# EAGLE design ControlBox-3.1 (EAGLE 9.6.1)

## Sheet 1 of 3
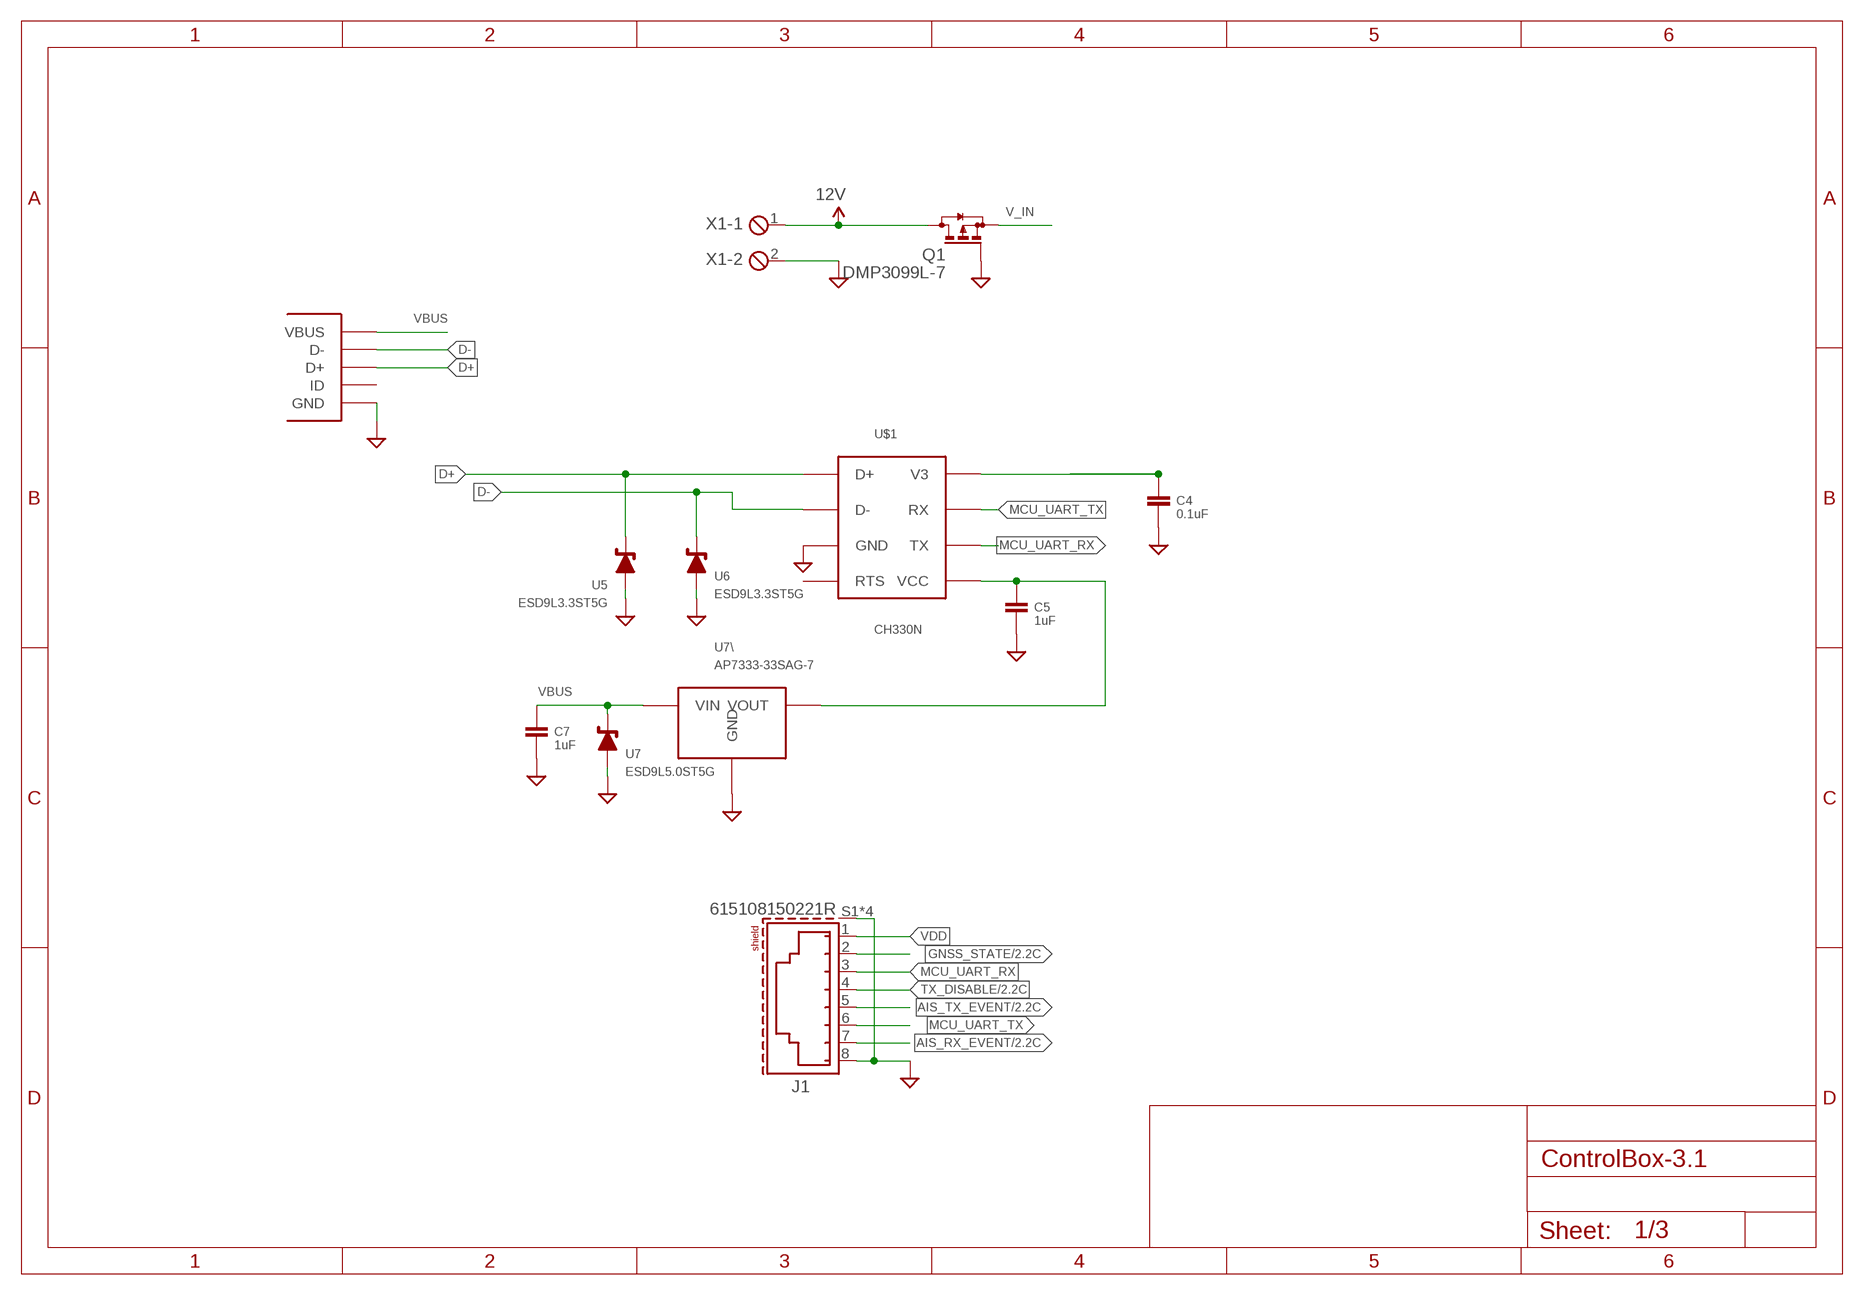
[diagram p0: schematic, sheet 1]

### Parts
C4  0.1uF  CAPACITOR0603  [0603]
C5  1uF  CAPACITOR0603  [0603]
C7  1uF  CAPACITOR0603  [0603]
J1  615108150221R  [615108150221R]
Q1  DMP3099L-7  BSS84  [SOT23]
U5  ESD9L3.3ST5G  [SODFL1006X40N]
U6  ESD9L3.3ST5G  [SODFL1006X40N]
U7  ESD9L5.0ST5G  [SODFL1006X40N]
U7\  AP7333-33SAG-7  [SOT-23]
U$1  CH330N  [SOIC-8]
U$2  MICRO_USB  [MICRO_USB]
X1  MPT2  [2POL254]

### Nets
12V: Q1.3(D) X1.1
AIS_RX_EVENT: J1.7 ; also sheet 2
AIS_TX_EVENT: J1.5 ; also sheet 2
D+: U5.1 U$1.1(D+) U$2.D+
D-: U6.1 U$1.2(D-) U$2.D-
GND: C4.P$2 C5.P$2 C7.P$2 J1.8 J1.S1(SHIELD) J1.S2(SHIELD) J1.S3(SHIELD) J1.S4(SHIELD) Q1.1(G) U5.2 U6.2 U7.2 U7\.3(GND) U$1.3(GND) U$2.GND U$2.MT1(GND) U$2.MT2(GND) U$2.P$1(GND) U$2.P$2(GND) X1.2 ; also sheet 2,3
GNSS_STATE: J1.2 ; also sheet 2
MCU_UART_RX: J1.3 U$1.6(TX)
MCU_UART_TX: J1.6 U$1.7(RX)
N$10: C4.P$1 U$1.8(V3)
N$12: C5.P$1 U7\.2(VOUT) U$1.5(VCC)
TX_DISABLE: J1.4 ; also sheet 2
V_IN: Q1.2(S) ; also sheet 3
VBUS: C7.P$1 U7.1 U7\.1(VIN) U$2.VBUS
VDD: J1.1 ; also sheet 3
Unconnected: U$1.4(RTS) U$2.ID

## Sheet 2 of 3
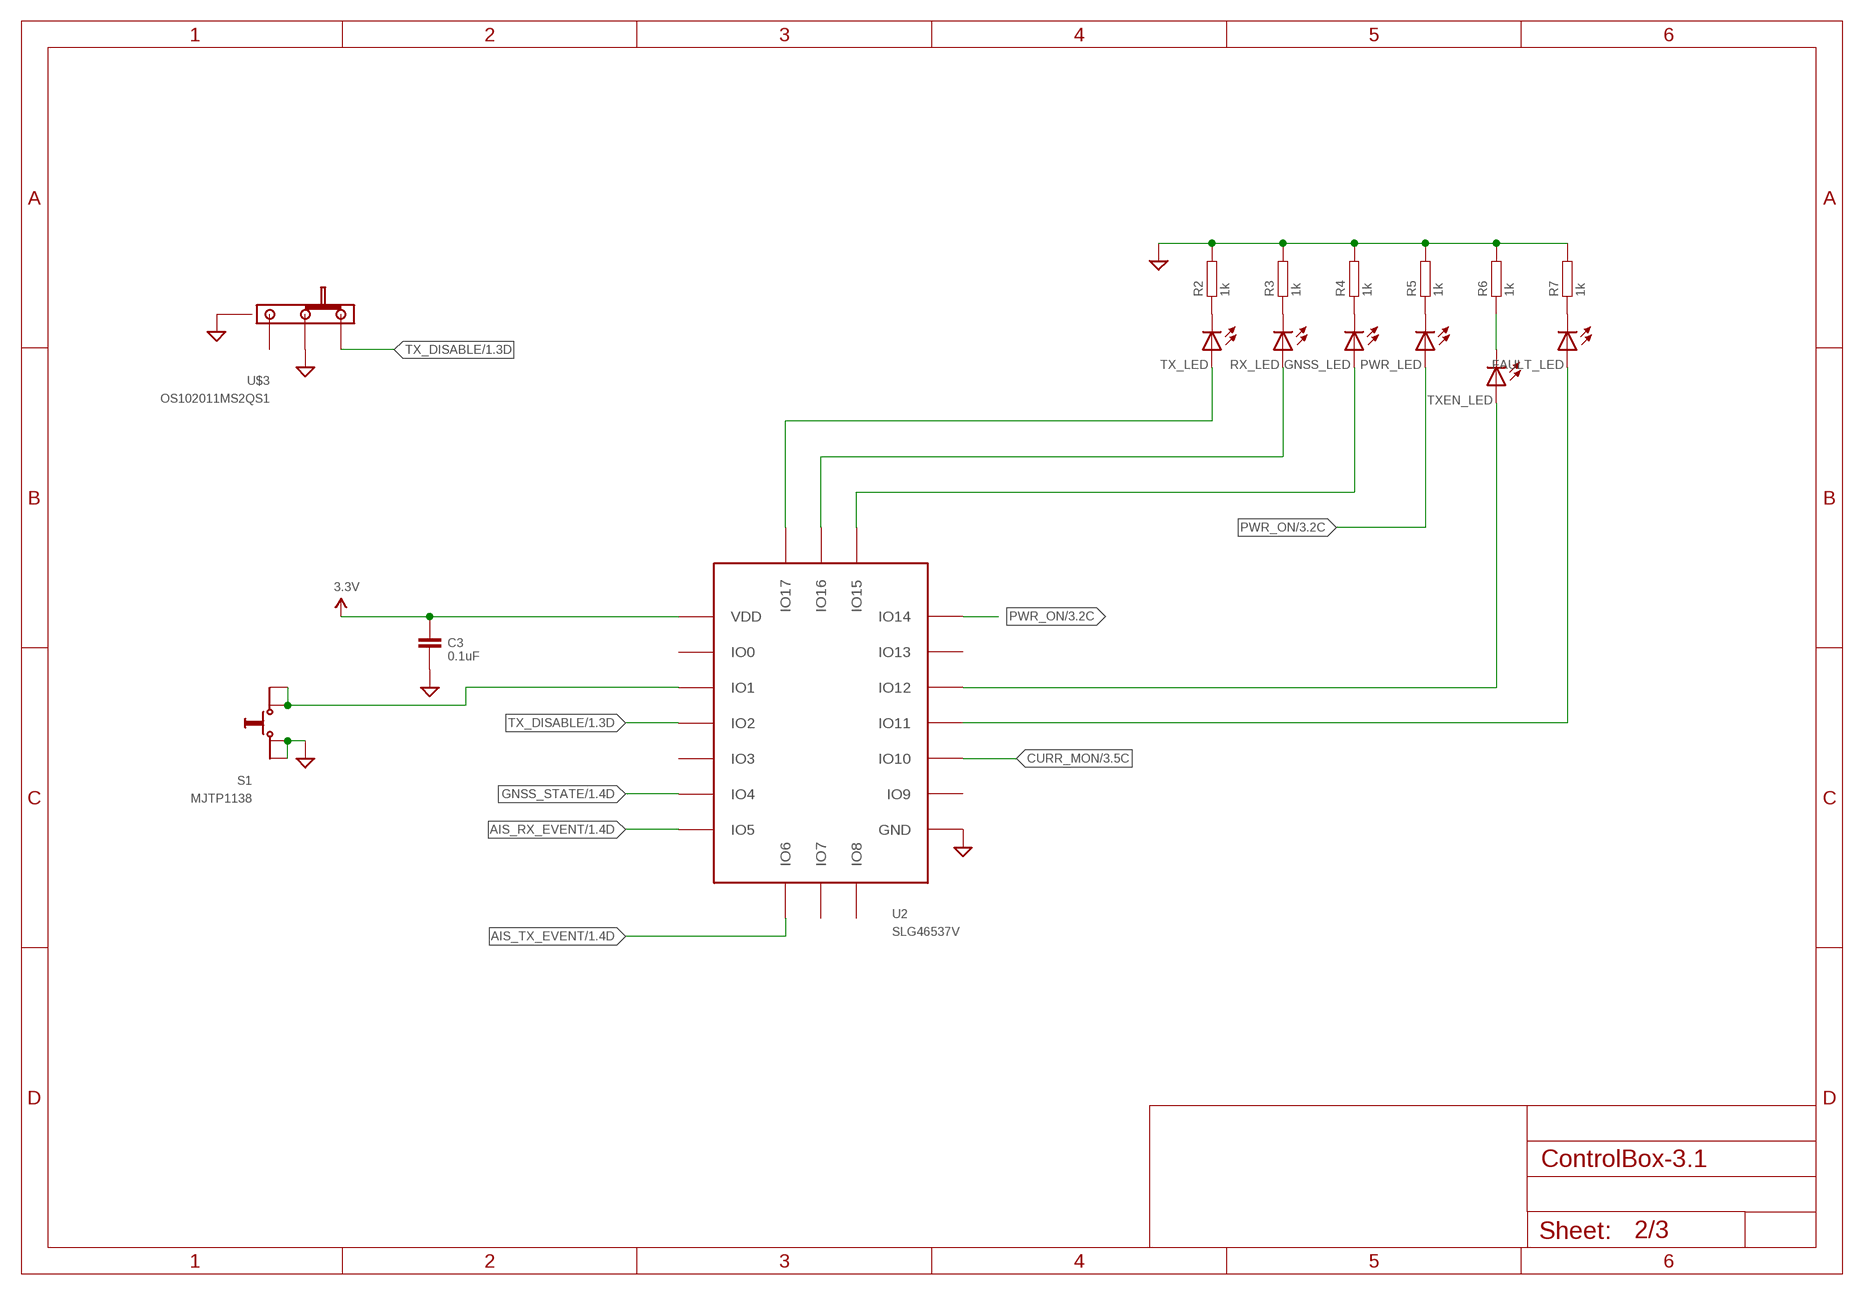
[diagram p1: schematic, sheet 2]

### Parts
C3  0.1uF  CAPACITOR0603  [0603]
FAULT_LED  LEDCHIPLED_0603  [CHIPLED_0603]
GNSS_LED  LEDCHIPLED_0603  [CHIPLED_0603]
PWR_LED  LEDCHIPLED_0603  [CHIPLED_0603]
R2  1k  RESISTOR0603  [0603]
R3  1k  RESISTOR0603  [0603]
R4  1k  RESISTOR0603  [0603]
R5  1k  RESISTOR0603  [0603]
R6  1k  RESISTOR0603  [0603]
R7  1k  RESISTOR0603  [0603]
RX_LED  LEDCHIPLED_0603  [CHIPLED_0603]
S1  MJTP1138  [MJTP1138]
TX_LED  LEDCHIPLED_0603  [CHIPLED_0603]
TXEN_LED  LEDCHIPLED_0603  [CHIPLED_0603]
U2  SLG46537V  SLG46537  [STQFN20L]
U$3  OS102011MS2QS1  [SPDT-PTH]

### Nets
3.3V: C3.P$1 U2.P$1(VDD) ; also sheet 3
AIS_RX_EVENT: U2.P$7(IO5) ; also sheet 1
AIS_TX_EVENT: U2.P$8(IO6) ; also sheet 1
BTN: S1.P$1(A) S1.P$4(A) U2.P$3(IO1)
CURR_MON: U2.P$13(IO10) ; also sheet 3
FAULT_LED: FAULT_LED.A U2.P$14(IO11)
GND: C3.P$2 R2.P$2 R3.P$2 R4.P$2 R5.P$2 R6.P$2 R7.P$2 S1.P$2(B) S1.P$3(B) U2.P$11(GND) U$3.P$2 U$3.P$4(SHLD) U$3.P$5(SHLD) ; also sheet 1,3
GNSS_LED: GNSS_LED.A U2.P$18(IO15)
GNSS_STATE: U2.P$6(IO4) ; also sheet 1
N$2: R2.P$1 TX_LED.C
N$3: R3.P$1 RX_LED.C
N$4: GNSS_LED.C R4.P$1
N$5: PWR_LED.C R5.P$1
N$6: R6.P$1 TXEN_LED.C
N$7: FAULT_LED.C R7.P$1
PWR_ON: PWR_LED.A U2.P$17(IO14) ; also sheet 3
RX_LED: RX_LED.A U2.P$19(IO16)
TX_DISABLE: U2.P$4(IO2) U$3.P$1 ; also sheet 1
TX_EN_LED: TXEN_LED.A U2.P$15(IO12)
TX_LED: TX_LED.A U2.P$20(IO17)
Unconnected: U2.P$2(IO0) U2.P$5(IO3) U2.P$9(IO7) U2.P$10(IO8) U2.P$12(IO9) U2.P$16(IO13) U$3.P$3

## Sheet 3 of 3
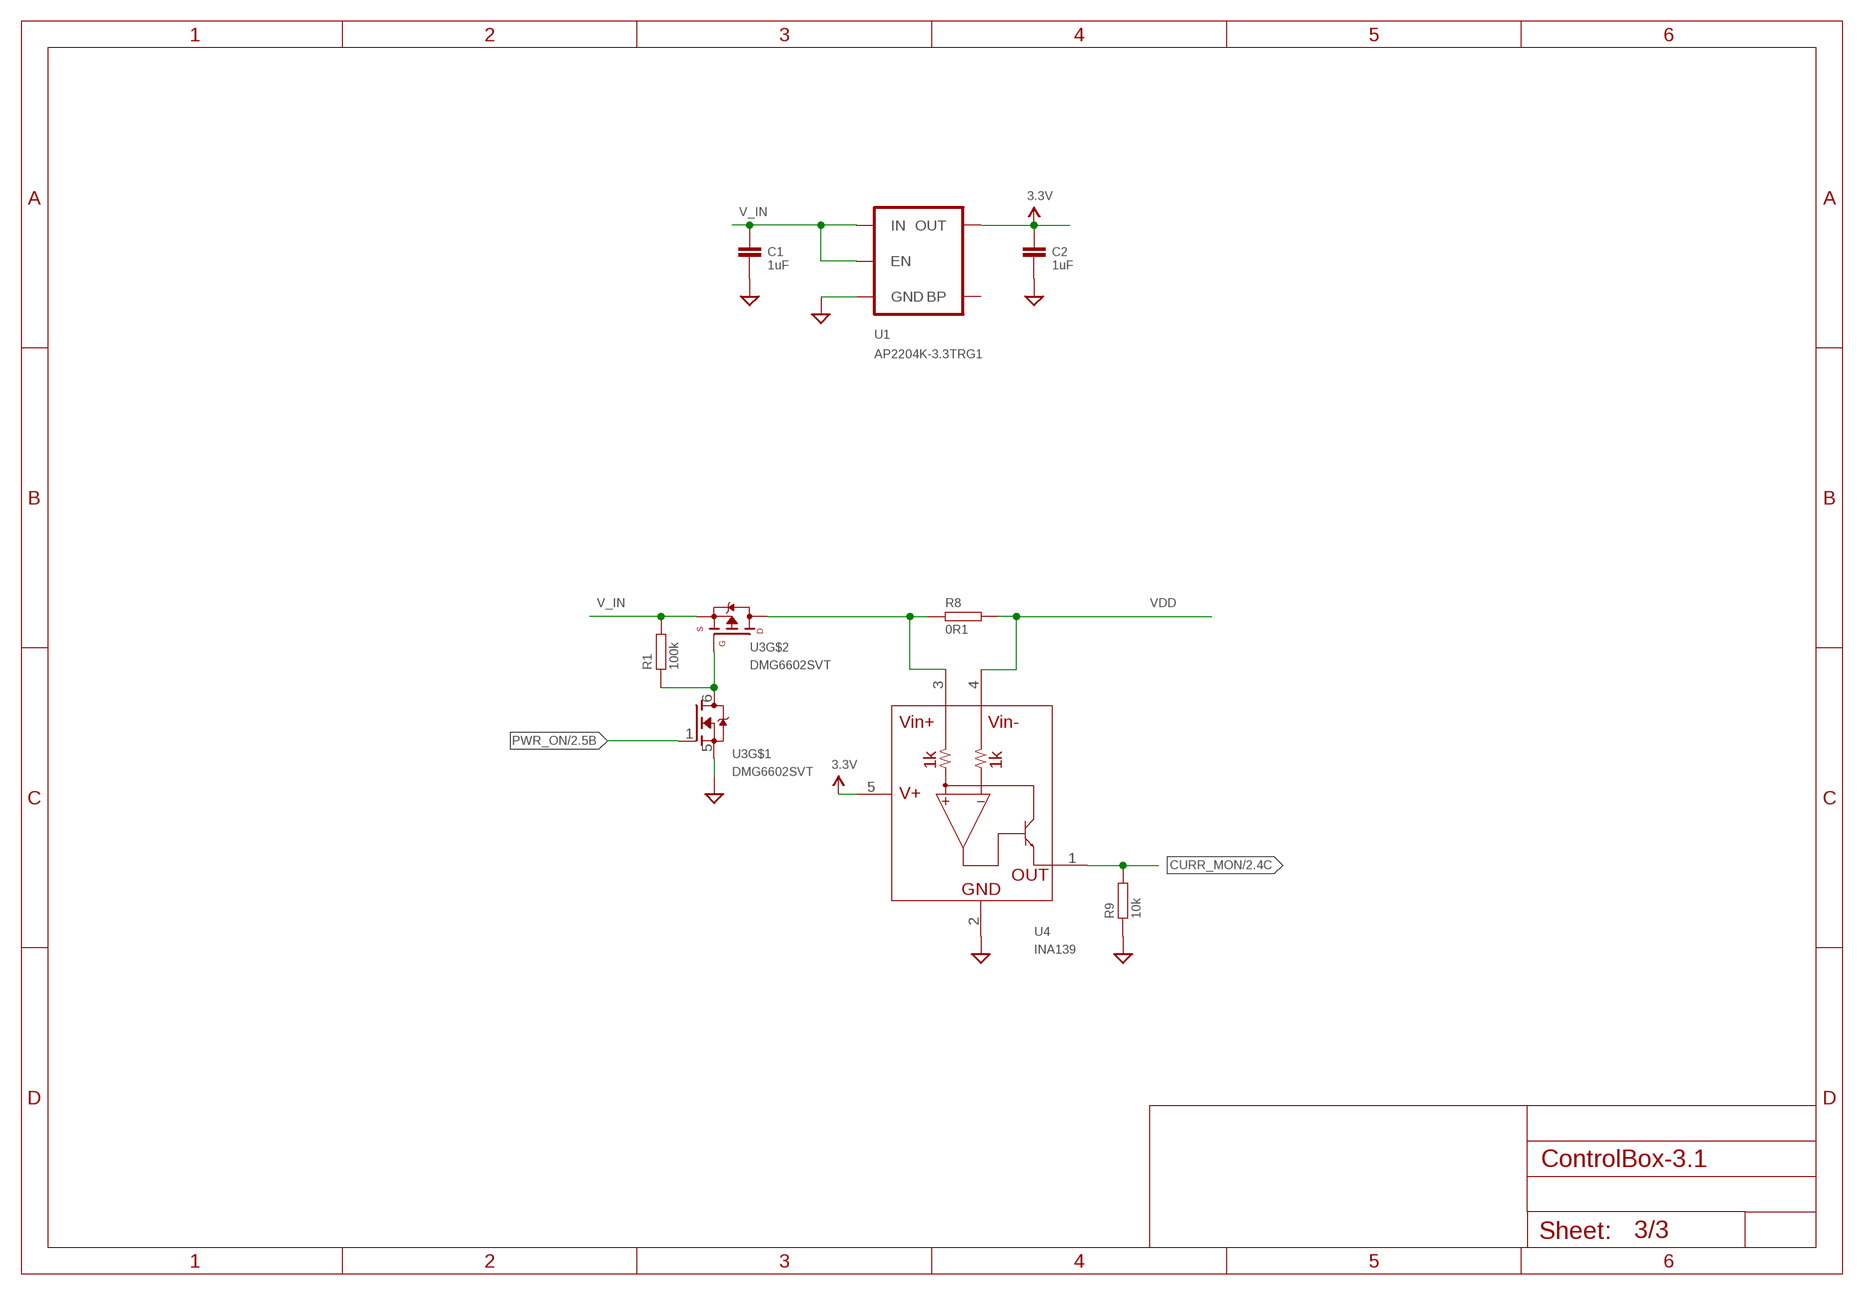
[diagram p2: schematic, sheet 3]

### Parts
C1  1uF  CAPACITOR0603  [0603]
C2  1uF  CAPACITOR0603  [0603]
R1  100k  RESISTOR0603  [0603]
R8  0R1  RESISTOR1206  [1206]
R9  10k  RESISTOR0603  [0603]
U1  AP2204K-3.3TRG1  V_REG_LDOSMD  [SOT23-5]
U3  DMG6602SVT  [SOT23-6]
U4  INA139  INA169  [SOT23-5]

### Nets
3.3V: C2.P$1 U1.5(OUT) U4.5(V+) ; also sheet 2
CURR_MON: R9.P$2 U4.1(OUT) ; also sheet 2
GND: C1.P$2 C2.P$2 R9.P$1 U1.2(GND) U3.5(S) U4.2(GND) ; also sheet 1,2
N$1: R1.P$1 U3.3(G) U3.6(D)
N$11: R8.P$1 U3.4(D) U4.3(VIN+)
PWR_ON: U3.1(G) ; also sheet 2
V_IN: C1.P$1 R1.P$2 U1.1(IN) U1.3(EN) U3.2(S) ; also sheet 1
VDD: R8.P$2 U4.4(VIN-) ; also sheet 1
Unconnected: U1.4(BP)

## Library data of the parts
C1-C5 C7 = MyPassives:CAPACITOR: Standard SMD capacitor
FAULT_LED GNSS_LED PWR_LED RX_LED TX_LED TXEN_LED = led:LED: LED OSRAM: - CHIPLED LG R971, LG N971, LY N971, LG Q971, LY Q971, LO R971, LY R971 LH N974, LH R974 LS Q976, LO Q976, LY Q976 LO Q996 - Hyper CHIPLED LW Q18S LB Q993, LB Q99A, LB R99A - SideLED LS A670, LO A670, LY A670, LG A670, LP A670 LB A673, LV A673, LT A673, LW A673 LH A674 LY A675 LS A676, LA A676, LO A676, LY A676, LW A676 LS A679, LY A679, LG A679 - Hyper Micro SIDELED® LS Y876, LA Y876, LO Y876, LY Y876 LT Y87S - SmartLED LW L88C, LW L88S LB L89C, LB L89S, LG L890 LS L89K, LO L89K, LY L89K LS L896, LA L896, LO L896, LY L896 - TOPLED LS T670, LO T670, LY T670, LG T670, LP T670 LSG T670, LSP T670, LSY T670, LOP T670, LYG T670 LG T671, LOG T671, LSG T671 LB T673, LV T673, LT T673, LW T673 LH T674 LS T676, LA T676, LO T676, LY T676, LB T676, LH T676, LSB T676, LW T676 LB T67C, LV T67C, LT T67C, LS T67K, LO T67K, LY T67K, LW E67C LS E67B, LA E67B, LO E67B, LY E67B, LB E67C, LV E67C, LT E67C LW T67C LS T679, LY T679, LG T679 LS T770, LO T770, LY T770, LG T770, LP T770 LB T773, LV T773, LT T773, LW T773 LH T774 LS E675, LA E675, LY E675, LS T675 LS T776, LA T776, LO T776, LY T776, LB T776 LHGB T686 LT T68C, LB T68C - Hyper Mini TOPLED® LB M676 - Mini TOPLED Santana® LG M470 LS M47K, LO M47K, LY M47K Source: http://www.osram.convergy.de LUXEON: - LUMILED® LXK2-PW12-R00, LXK2-PW12-S00, LXK2-PW14-U00, LXK2-PW14-V00 LXK2-PM12-R00, LXK2-PM12-S00, LXK2-PM14-U00 LXK2-PE12-Q00, LXK2-PE12-R00, LXK2-PE12-S00, LXK2-PE14-T00, LXK2-PE14-U00 LXK2-PB12-K00, LXK2-PB12-L00, LXK2-PB12-M00, LXK2-PB14-N00, LXK2-PB14-P00, LXK2-PB14-Q00 LXK2-PR12-L00, LXK2-PR12-M00, LXK2-PR14-Q00, LXK2-PR14-R00 LXK2-PD12-Q00, LXK2-PD12-R00, LXK2-PD12-S00 LXK2-PH12-R00, LXK2-PH12-S00 LXK2-PL12-P00, LXK2-PL12-Q00, LXK2-PL12-R00 Source: www.luxeon.com KINGBRIGHT: KA-3528ASYC Source: www.kingbright.com
J1 = 615108150221R:615108150221R: WR-MJ Modular Jack THR Horizontal Mid-Mount Shielded Tab Down General Information Operating Temperature:-40 up to +85 °C Compliance:Lead free / RoHS Electrical Properties Working Voltage: 125 V (AC) Contact Resistance:20mΩ RISO:1000 MΩ Material Properties Insulator MateriaL:LCP Insulator Flammability Rating:UL94 V-0 Color:Black Contact Material:Copper Alloy Contact Plating: Gold Contact Type:Stamped Shielding Materia:Brass Shielding Plating:Nickel Packaging Properties Packaging:Tape and Reel <https://www.we-online.com/catalog/media/o135233v209%20Family_WR-MJ_615108150221R.jpg> Details see: https://www.we-online.com/catalog/en/MJ_THR_HORIZONTAL_MID_MOUNT_SHIELDED_TAB_DOWN/ Updated by Yingchun,Shan 2020-01-03 2020 (C) Würth Elektronik Check prices <https://pricing.snapeda.com/search/part/615108150221R/?ref=eda>; AVAILABILITY: Warning; DESCRIPTION: Jack Modular Connector 8p8c (RJ45, Ethernet) 90° Angle (Right) Shielded; MF: Würth Elektronik; MP: 615108150221R; PACKAGE: None; PRICE: None; PURCHASE-URL: https://pricing.snapeda.com/search/part/615108150221R/?ref=eda
Q1 = transistor-small-signal:BSS84: P-CHANNEL MOS FET
R1-R9 = MyPassives:RESISTOR: Standard SMD resistor
S1 = apem-switch:MJTP1138: SMD Tactile switch; PARTNO: MJTP1138
U1 = SparkFun-PowerIC:V_REG_LDO: Voltage Regulator LDO Standard 150mA LDO voltage regulator in SOT-23 layout. Micrel part MIC5205. BP (by-pass) pin is used to lower output noise with 470pF cap.
U2 = dialog-greenpak:SLG46537: Programmable Mixed Signal Matrix
U3 = diodesinc:DMG6602SVT: N/P channel MOSFET array
U4 = SparkFun-AnalogIC:INA169
U5 U6 = ESD9L3.3ST5G:ESD9L3.3ST5G: None; AVAILABILITY: Unavailable; DESCRIPTION: 9.8V Clamp 1A _8/20µs_ Ipp Tvs Diode Surface Mount SOD-923; MF: ON Semiconductor; MP: ESD9L3.3ST5G; PACKAGE: SOD-923 ON Semiconductor; PARTNO: ESD9L3.3ST5G; PRICE: None
U7 = ESD9L5.0ST5G:ESD9L5.0ST5G: None; AVAILABILITY: Unavailable; DESCRIPTION: 9.8V Clamp 1A _8/20µs_ Ipp Tvs Diode Surface Mount SOD-923; MF: ON Semiconductor; MP: ESD9L5.0ST5G; PACKAGE: SOD-923 ON Semiconductor; PARTNO: ESD9L5.0ST5G; PRICE: None
U7\ = diodesinc:AP7333-33SAG-7: 3.3V 300mA LDO regulator (SOT23)
U$1 = JiangsuQinHeng:CH330N: USB to UART bridge
U$2 = MyUSBConnectors:MICRO_USB
U$3 = slide-switches:OS102011MS2QS1: Through hole slider switch (SPDT)
X1 = con-phoenix-254:MPT2: PHOENIX CONNECTOR; OC_FARNELL: unknown; OC_NEWARK: unknown

## Board
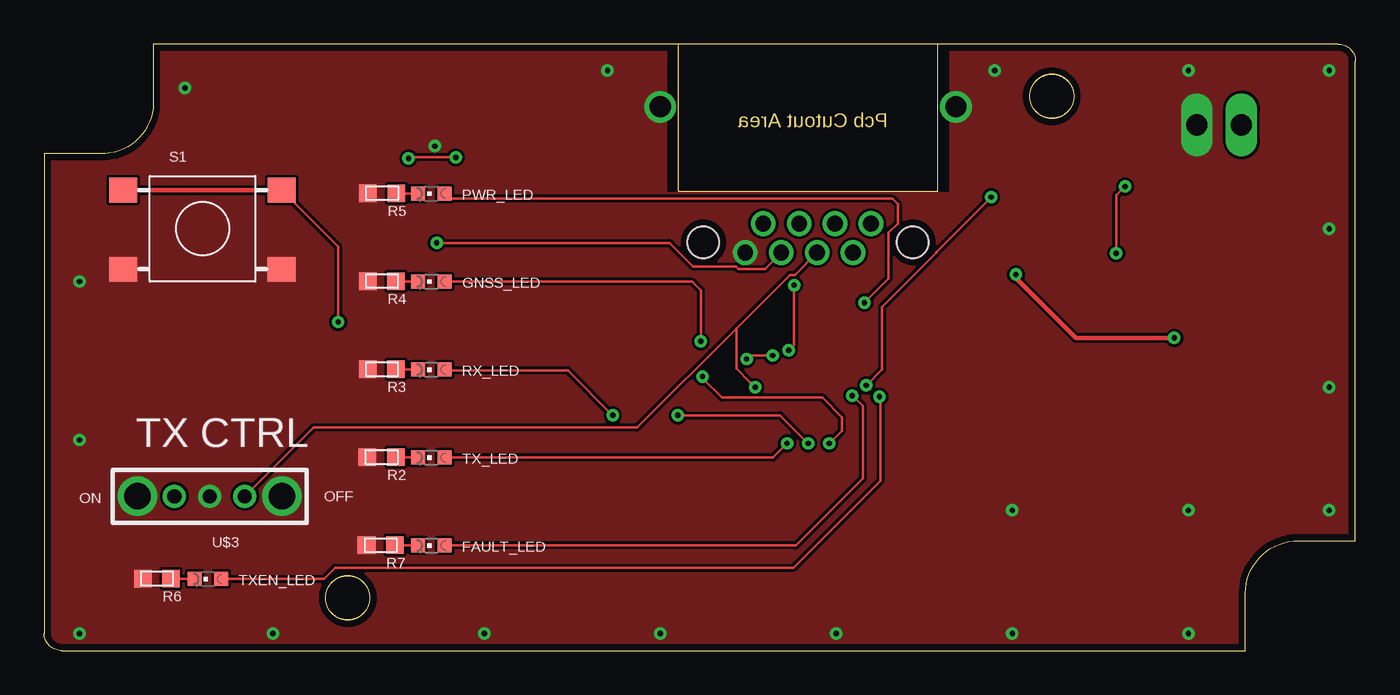
[diagram p3: board, top side]
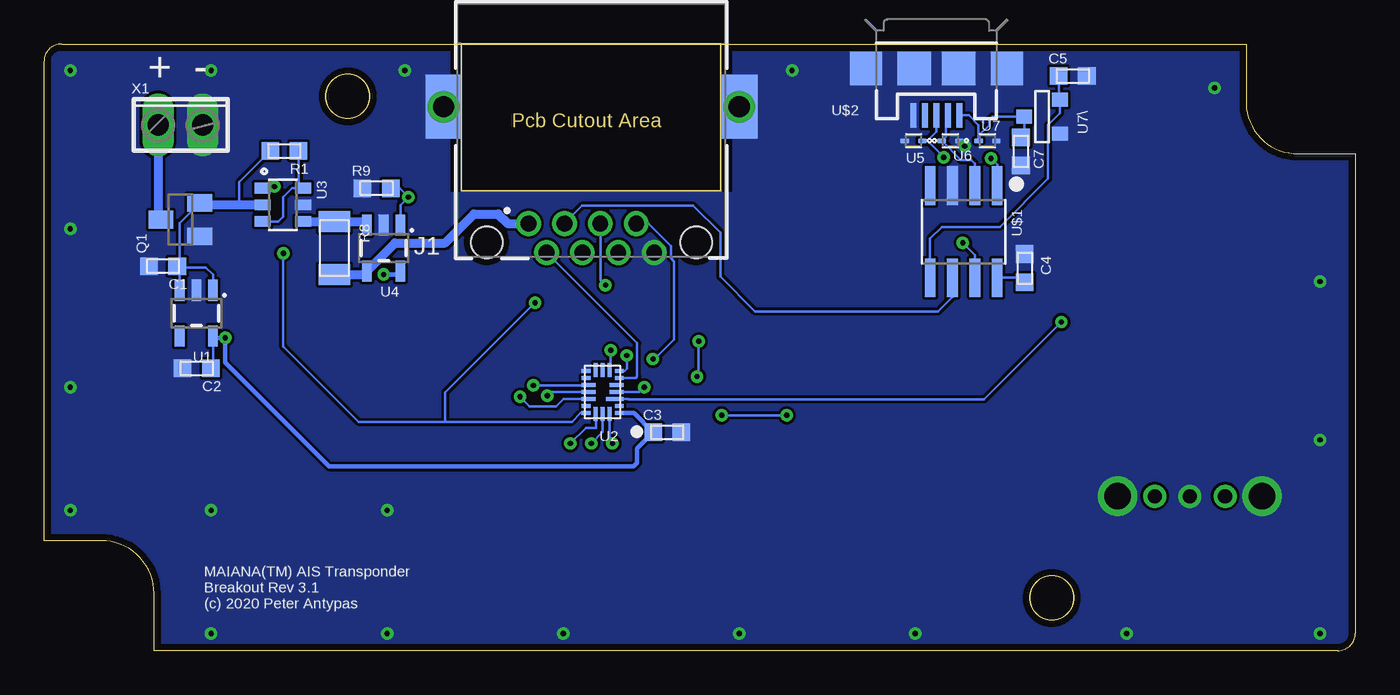
[diagram p4: board, bottom side, seen from below]

Size 74.5 x 34.47 mm. Coordinates in mm from the lower left corner, seen from the top.
Outline: 16,3 arc-180 18.5,3
Outline: 18.5,3 arc-180 16,3
Outline: 56,31.5 arc-180 58.5,31.5
Outline: 58.5,31.5 arc-180 56,31.5
Outline: 68.25,3.25 arc-90 71.25,6.25
Outline: 68.25,3.25 arc-90 71.25,6.25
Outline: 73.51,34.47 arc-90 74.5,33.5
Outline: 73.51,34.47 arc-90 74.5,33.5
Outline: 6.21,31.07 arc-90 3.25,28.25
Outline: 6.21,31.07 arc-90 3.25,28.25
Outline: 1,0 arc-90 0,1
Outline: 1,0 arc-90 0,1
Outline: 68.25,3.25 arc-90 71.25,6.25
Outline: 73.51,34.47 arc-90 74.5,33.5
Outline: 6.21,31.07 arc-90 3.25,28.25
Outline: 1,0 arc-90 0,1
Outline: 68.25,3.25 68.25,0 1,0
Outline: 1,0 arc-90 0,1
Outline: 0,1 0,28.25 3.25,28.25
Outline: 6.21,31.07 arc-90 3.25,28.25
Outline: 6.21,31.07 6.21,34.47 73.51,34.47
Outline: 73.51,34.47 arc-90 74.5,33.5
Outline: 74.5,33.5 74.5,6.25 71.25,6.25
Outline: 68.25,3.25 arc-90 71.25,6.25
Outline: 16,3 arc-180 18.5,3
Outline: 18.5,3 arc-180 16,3
Outline: 56,31.5 arc-180 58.5,31.5
Outline: 58.5,31.5 arc-180 56,31.5
Outline: circle at 17.25,3 radius 1.25
Outline: circle at 57.25,31.5 radius 1.25
Outline: circle at 17.25,3 radius 1.25
Outline: circle at 57.25,31.5 radius 1.25
Copper layers (1*16): Top 0.035mm / dielectric 1.5mm / Bottom 0.035mm
Design rules "default *": minimum track width 6mil, minimum drill 0.3mm, track to track 6mil, track to pad 6mil, pad to pad 6mil, via to via 6mil, smd to smd 0mil, copper to edge 15mil, drill to drill 6mil, minimum pad ring 10mil, minimum via ring 8mil, stop-mask expansion 4mil, vias tented up to drill 20mil, thermal gap 10mil

### Footprints (pad centres in the part's own frame; a part is rotated, then mirrored left to right if it is on the bottom)
0603 = smd 1 x 1: P$1 -0.8,0; P$2 0.8,0
CHIPLED_0603 = smd 0.8 x 0.8: A 0,-0.75; C 0,0.75
615108150221R = drill 0.9: 1 3.57,5.3; 2 2.55,6.95; 3 1.53,5.3; 4 0.51,6.95; 5 -0.51,5.3; 6 -1.53,6.95; 7 -2.55,5.3; 8 -3.57,6.95 | smd 2.05 x 3.63: S1 -8.4,-1.33; S3 8.4,-1.33 | drill 1.2: S2 -8.4,-1.33; S4 8.4,-1.33 | hole 1.8: 5.95,6.37; -5.95,6.37
SOT23 = smd 1 x 1.4: 1 -0.95,-1.1; 2 0.95,-1.1; 3 0,1.1
1206 = smd 1.2 x 1.8: P$1 -1.5,0; P$2 1.5,0
MJTP1138 = smd 1.6 x 1.4: P$1 -4.5,2.2; P$2 -4.5,-2.3; P$3 4.5,-2.3; P$4 4.5,2.2
SOT23-5 = smd 0.55 x 1.2: 1 -0.95,-1.3; 2 0,-1.3; 3 0.95,-1.3; 4 0.95,1.3; 5 -0.95,1.3
STQFN20L = smd 0.5 x 0.23: P$1 -0.95,1.1; P$2 -0.95,0.7; P$6 -0.95,-0.9; P$7 -0.95,-1.3; P$11 0.95,-1.3; P$12 0.95,-0.9; P$16 0.95,0.7; P$17 0.95,1.1 | smd 1 x 0.23: P$3 -0.7,0.3 | smd 0.8 x 0.23: P$4 -0.8,-0.1; P$5 -0.8,-0.5; P$13 0.8,-0.5; P$14 0.8,-0.1; P$15 0.8,0.3 | smd 0.23 x 0.8: P$8 -0.4,-1.35; P$9 0,-1.35; P$10 0.4,-1.35; P$18 0.4,1.15; P$19 0,1.15; P$20 -0.4,1.15
SOT23-6 = smd 0.6 x 0.9: 1 -0.95,-1.15; 2 0,-1.15; 3 0.95,-1.15; 4 0.95,1.15; 5 0,1.15; 6 -0.95,1.15
SODFL1006X40N = smd 0.5 x 0.3: 1 -0.5,0; 2 0.5,0
SOT-23 = smd 0.787 x 0.889: 1 0.025,-1.016; 2 -0.94,1.016; 3 0.991,1.016
SOIC-8 = smd 2.21 x 0.61: 1 -2.616,1.905; 2 -2.616,0.635; 3 -2.616,-0.635; 4 -2.616,-1.905; 5 2.616,-1.905; 6 2.616,-0.635; 7 2.616,0.635; 8 2.616,1.905
MICRO_USB = smd 0.35 x 1.4: D+ 0,2.65; D- -0.65,2.65; GND 1.3,2.65; ID 0.65,2.65; VBUS -1.3,2.65 | smd 1.8 x 1.9: MT1 -4,0; MT2 4,0 | smd 1.9 x 1.9: P$1 -1.27,0; P$2 1.27,0
SPDT-PTH = drill 0.8: P$1 -2,0; P$2 0,0; P$3 2,0 | drill 1.5: P$4 -4.1,0; P$5 4.1,0
2POL254 = drill 1.2 long: 1 -1.27,0; 2 1.27,0

### Placement (x,y rotation side)
C1  67.74,21.84 180 bottom
C2  65.83,16.04 180 bottom
C3  39.1,12.4 0 bottom
C4  18.79,21.73 90 bottom
C5  16.06,32.65 0 bottom
C7  19.01,28.37 270 bottom
FAULT_LED  22.01,5.97 90 top
GNSS_LED  22.01,20.97 90 top
J1  43.41,29.57 180 bottom
PWR_LED  22.01,25.97 90 top
Q1  66.76,24.49 90 bottom
R1  60.85,28.39 180 bottom
R2  19.18,10.99 180 top
R3  19.19,15.99 180 top
R4  19.2,20.99 180 top
R5  19.21,25.99 180 top
R6  6.42,4.09 180 top
R7  19.13,5.99 180 top
R8  58.01,22.87 270 bottom
R9  55.61,26.27 0 bottom
RX_LED  22.01,15.97 90 top
S1  9.01,23.97 0 top
TX_LED  22.01,10.97 90 top
TXEN_LED  9.31,4.07 90 top
U1  65.85,19.17 180 bottom
U2  42.77,14.6 180 bottom
U3  60.94,25.33 270 bottom
U4  55.21,22.87 180 bottom
U5  25.11,28.97 180 bottom
U6  23.01,28.97 0 bottom
U7  20.91,28.97 0 bottom
U7\  17.81,30.37 270 bottom
U$1  22.26,23.8 270 bottom
U$2  23.81,33.07 180 bottom
U$3  9.41,8.77 180 top
X1  66.75,29.87 0 bottom

### Tracks (layer width: path | path; a pad name or v marks a point on that pad's centre or on a via)
3.3V  (via drill 0.3)
  Top 0.254: v64.21,17.77 58.61,17.77 55.21,21.17 v55.21,21.37
  Bottom 0.152: U1.5 64.9,16.17 C2.P$1
  Bottom 0.254: U1.5 64.8,17.77 v64.21,17.77 64.21,16.37 58.31,10.47 41.01,10.47 40.81,10.67 40.81,11.49 C3.P$1 41,13.5 U2.P$1 | v55.21,21.37 54.46,21.37 U4.5
12V
  Bottom 0.508: X1.1 68.02,24.65 Q1.3
AIS_RX_EVENT  (via drill 0.3)
  Top 0.152: v39.91,16.57 40.11,16.77 v41.39,16.77
  Bottom 0.152: v39.91,16.57 39.81,16.57 38.71,17.67 38.71,22.12 38.88,22.3 38.88,22.99 40.17,24.27 J1.7 | v41.39,16.77 41.39,16.03 41.52,15.9 U2.P$7
AIS_TX_EVENT  (via drill 0.3)
  Top 0.152: v42.61,20.77 42.61,17.37 v42.31,17.07
  Bottom 0.152: v42.31,17.07 42.31,16.01 U2.P$8 | J1.5 42.9,21.06 v42.61,20.77
BTN  (via drill 0.3)
  Top 0.152: S1.P$4 16.71,22.97 v16.71,18.67
  Top 0.254: S1.P$1 S1.P$4
  Bottom 0.152: v16.71,18.67 21.11,14.27 41.3,14.27 41.33,14.3 U2.P$3
CURR_MON  (via drill 0.3)
  Top 0.152: v53.81,25.77 50.69,22.66 50.69,22.62 47.61,19.53 47.61,15.97 v46.71,15.07
  Bottom 0.152: U4.1 54.26,25.32 v53.81,25.77 54.31,26.27 R9.P$2 | v46.71,15.07 43.6,15.07 U2.P$13
D+  (via drill 0.3)
  Top 0.152: v23.39,28.03 20.76,28.03 v20.71,27.97
  Bottom 0.152: U5.1 24.33,28.97 | 24.33,28.97 v23.39,28.03 | v20.71,27.97 20.35,27.62 U$1.1 | U$2.D+ 23.81,29.5 24.33,28.97
D-
  Bottom 0.152: U$1.2 21.62,27.69 21.81,27.87 22.41,27.87 U6.1 23.27,29.21 23.27,30.31 U$2.D-
FAULT_LED  (via drill 0.3)
  Top 0.152: v45.91,14.49 46.51,13.89 46.51,9.77 42.71,5.97 FAULT_LED.A
  Bottom 0.152: v45.91,14.49 45.69,14.7 U2.P$14
GND  (via drill 0.3)
  Top 0.254: 18.33,10.94 R2.P$2 | R3.P$2
  other vias: 22.21,28.67 2.01,0.97 13.01,0.97 2.01,11.97 2.01,20.97 8.01,31.97 32.01,32.97 54.01,32.97 65.01,32.97 73.01,32.97 73.01,23.97 73.01,14.97 73.01,7.97 65.01,7.97 55.01,7.97 65.01,0.97 55.01,0.97 45.01,0.97 35.01,0.97 25.01,0.97
  pour Top (no thermals): -0.99,38.97 75.01,38.97 75.01,-2.03 -0.99,-2.03
  pour Bottom (no thermals): -1.99,39.97 76.01,39.97 76.01,-3.03 -1.99,-3.03
GNSS_LED  (via drill 0.3)
  Top 0.152: v37.31,17.57 37.31,20.47 36.81,20.97 GNSS_LED.A | v44.61,11.77 45.32,12.49 45.32,13.26 44.21,14.37 38.51,14.37 37.41,15.47 v37.41,15.57
  Bottom 0.152: U2.P$18 43.14,13.42 43.14,12.66 43.72,12.66 v44.61,11.77 | v37.41,15.57 37.31,15.67 v37.31,17.57
GNSS_STATE
  Bottom 0.152: U2.P$6 40.88,15.5 40.81,15.57 40.81,17.47 J1.2
MCU_UART_RX
  Bottom 0.152: U$1.6 22.89,20.09 23.71,19.27 34.11,19.27 36.08,21.25 36.08,23.75 37.62,25.29 43.92,25.29 J1.3
MCU_UART_TX  (via drill 0.3)
  Top 0.152: v22.31,23.17 35.53,23.17 36.87,21.83 39.31,21.83 39.45,21.69 40.94,21.69 J1.6
  Bottom 0.152: U$1.7 21.62,22.49 v22.31,23.17
N$1
  Bottom 0.152: R1.P$1 60.05,26.54 U3.6 60.4,26.28 60.91,25.77 60.91,24.67 61.2,24.38 U3.3
N$2
  Top 0.152: TX_LED.C 20,10.97 R2.P$1
N$3
  Top 0.152: RX_LED.C 20.01,15.97 R3.P$1
N$4
  Top 0.152: GNSS_LED.C 20.02,20.97 R4.P$1
N$5
  Top 0.152: PWR_LED.C 20.03,25.97 R5.P$1
N$6
  Top 0.152: TXEN_LED.C 7.24,4.07 R6.P$1
N$7
  Top 0.152: FAULT_LED.C 19.95,5.97 R7.P$1
N$10
  Bottom 0.152: C4.P$1 19.04,21.19 U$1.8
N$11
  Bottom 0.508: U3.4 R8.P$1 56.36,24.37 U4.3
N$12
  Bottom 0.152: C5.P$1 16.86,31.38 U7\.2 16.79,30.54 17.46,29.87 17.46,26.82 20.21,24.07 23.51,24.07 24.16,23.42 U$1.5
PWR_ON  (via drill 0.3)
  Top 0.152: v60.91,22.57 60.91,25.87 v61.41,26.37 | PWR_LED.A 23.06,25.67 48.21,25.67 48.51,25.37 48.51,24.27 47.98,23.75 47.98,21.15 v46.61,19.77
  Bottom 0.152: 51.71,13 56.64,13 60.91,17.27 v60.91,22.57 | 51.71,13 44.52,13 44.02,13.5 U2.P$17 | v61.41,26.37 62,26.37 U3.1 | v46.61,19.77 51.71,14.67 51.71,13
RX_LED  (via drill 0.3)
  Top 0.152: v32.31,13.37 29.76,15.92 22.81,15.92 RX_LED.A | v36.01,13.37 41.81,13.37 v43.41,11.77
  Bottom 0.152: v32.31,13.37 v36.01,13.37 | v43.41,11.77 v43.41,11.78 42.77,12.42 U2.P$19
TX_DISABLE  (via drill 0.3)
  Top 0.152: 39.32,18.31 42.37,21.36 42.65,21.36 J1.4 | 39.32,18.31 39.32,16.03 40.11,15.25 40.13,15.25 v40.41,14.97 | 39.32,18.31 33.68,12.67 15.31,12.67 U$3.P$1
  Bottom 0.152: v40.41,14.97 40.68,14.7 U2.P$4
TX_EN_LED  (via drill 0.3)
  Top 0.152: TXEN_LED.A 15.9,4.07 16.53,4.71 42.57,4.71 47.51,9.65 47.51,14.37 v47.46,14.42
  Bottom 0.152: U2.P$15 44.98,14.3 45.41,13.87 46.91,13.87 v47.46,14.42
TX_LED  (via drill 0.3)
  Top 0.152: v42.21,11.77 41.41,10.97 TX_LED.A
  Bottom 0.152: v42.21,11.77 42.37,11.93 U2.P$20
V_IN
  Bottom 0.152: Q1.2 66.8,24.3 66.8,21.87 | 66.8,21.87 66.8,21.77 | 66.8,21.77 U1.3 | U1.1 64.9,21.36 65.31,21.77 66.8,21.77 | C1.P$1 66.83,21.84 66.8,21.87 | R1.P$2 63.41,26.63 63.41,25.33
  Bottom 0.508: Q1.2 65.55,25.33 63.41,25.33 U3.2
VBUS
  Bottom 0.152: 21.41,29.27 21.41,29.17 U7.1 | 21.41,29.27 20.81,29.87 20.81,30.17 20.63,30.35 U7\.1 18.82,29.36 C7.P$1 | U$2.VBUS 21.96,30.42 21.41,29.87 21.41,29.27
VDD
  Bottom 0.406: 47,24.25 J1.1
  Bottom 0.508: R8.P$2 56.36,21.37 U4.4 54.56,23.17 51.72,23.17 50.07,24.82 48.7,24.82 48.14,24.25 47,24.25

### Text on the board
tPlace: TX CTRL
tNames: ON | OFF
bNames: - | + | MAIANA(TM) AIS Transponder / Breakout Rev 3.1 / (c) 2020 Peter Antypas